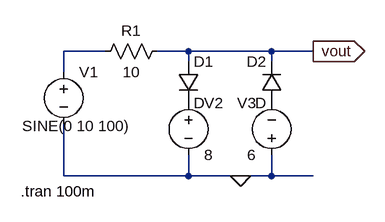
[diagram p0: schematic Cliper.asc]
Cliper.asc, the LTspice schematic file:
Version 4
SHEET 1 880 680
WIRE 32 96 -32 96
WIRE 160 96 112 96
WIRE 288 96 160 96
WIRE 352 96 288 96
WIRE 160 112 160 96
WIRE 288 112 288 96
WIRE -32 128 -32 96
WIRE -32 288 -32 208
WIRE 160 288 160 256
WIRE 160 288 -32 288
WIRE 240 288 160 288
WIRE 288 288 288 256
WIRE 288 288 240 288
WIRE 352 288 288 288
FLAG 240 288 0
FLAG 352 96 vout
IOPIN 352 96 Out
SYMBOL res 128 80 R90
WINDOW 0 0 56 VBottom 2
WINDOW 3 32 56 VTop 2
SYMATTR InstName R1
SYMATTR Value 10
SYMBOL voltage -32 112 R0
WINDOW 3 -64 99 Left 2
WINDOW 123 0 0 Left 0
WINDOW 39 0 0 Left 0
SYMATTR InstName V1
SYMATTR Value SINE(0 10 100)
SYMBOL diode 144 112 R0
SYMATTR InstName D1
SYMBOL diode 304 176 R180
WINDOW 0 24 64 Left 2
WINDOW 3 24 0 Left 2
SYMATTR InstName D2
SYMBOL voltage 160 160 R0
WINDOW 123 0 0 Left 0
WINDOW 39 0 0 Left 0
SYMATTR InstName V2
SYMATTR Value 8
SYMBOL voltage 288 272 R180
WINDOW 0 24 96 Left 2
WINDOW 3 24 16 Left 2
WINDOW 123 0 0 Left 0
WINDOW 39 0 0 Left 0
SYMATTR InstName V3
SYMATTR Value 6
TEXT -98 312 Left 2 !.tran 100m

The netlist it stands for:
* Cliper.asc
R1 vout N001 10
V1 N001 0 SINE(0 10 100)
D1 vout P001 D
D2 P002 vout D
V2 P001 0 8
V3 0 P002 6
.model D D
.lib standard.dio
.tran 100m
.backanno
.end